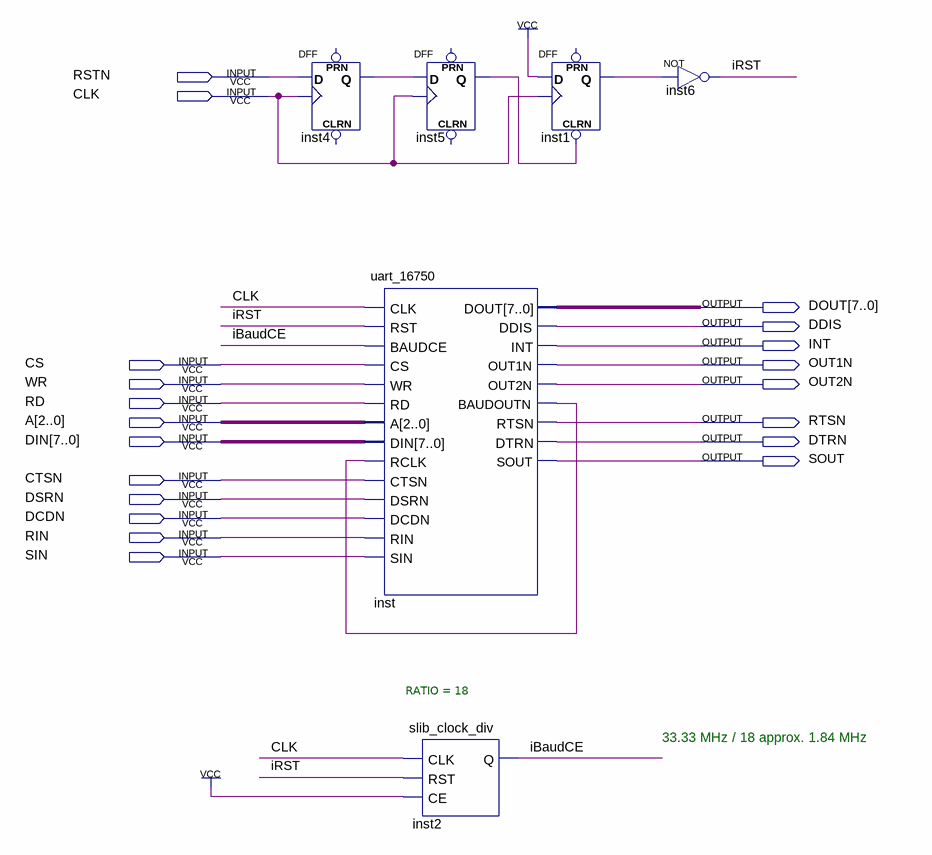
[diagram p0: schematic sheet]
// Quartus schematic UART16750.bdf as structural Verilog: 6 symbols, 20 pins
module UART16750 (
  input  RSTN,
  input  CLK,
  input  CS,
  input  WR,
  input  RD,
  input  [2:0] A,
  input  [7:0] DIN,
  input  CTSN,
  input  DSRN,
  input  DCDN,
  input  RIN,
  input  SIN,
  output [7:0] DOUT,
  output DDIS,
  output INT,
  output OUT1N,
  output OUT2N,
  output RTSN,
  output DTRN,
  output SOUT
);

  wire iBaudCE, inst1_q, inst4_q, inst5_q, inst_baudoutn, iRST;

  DFF inst4 (.CLK(CLK), .D(RSTN), .Q(inst4_q));  // open: CLRN, PRN
  DFF inst5 (.CLK(CLK), .D(inst4_q), .Q(inst5_q));  // open: CLRN, PRN
  uart_16750 inst (
    .CLK(CLK), .RST(iRST), .BAUDCE(iBaudCE), .CS(CS), .WR(WR), .RD(RD), .A(A), .DIN(DIN),
    .RCLK(inst_baudoutn), .CTSN(CTSN), .DSRN(DSRN), .DCDN(DCDN), .RIN(RIN), .SIN(SIN), .DOUT(DOUT),
    .DDIS(DDIS), .INT(INT), .OUT1N(OUT1N), .OUT2N(OUT2N), .BAUDOUTN(inst_baudoutn), .RTSN(RTSN), .DTRN(DTRN),
    .SOUT(SOUT));
  slib_clock_div #(.RATIO(18)) inst2 (.CLK(CLK), .RST(iRST), .CE(1'b1), .Q(iBaudCE));
  DFF inst1 (.CLRN(inst5_q), .CLK(CLK), .D(1'b1), .Q(inst1_q));  // open: PRN
  not inst6 (iRST, inst1_q);

  // Notes on the sheet:
  //   33.33 MHz / 18 approx. 1.84 MHz
endmodule
